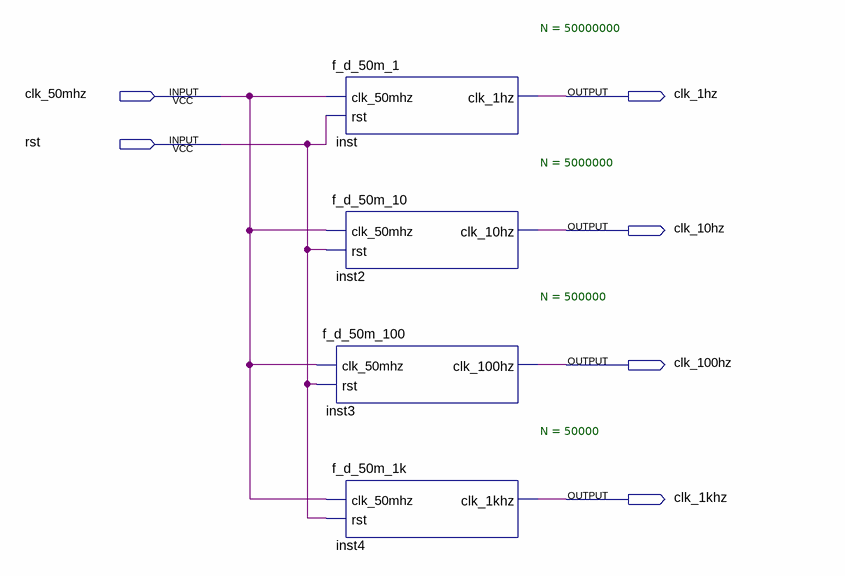
[diagram p0: schematic sheet]
// Quartus schematic f_d.bdf as structural Verilog: 4 symbols, 6 pins
module f_d (
  input  clk_50mhz,
  input  rst,
  output clk_1hz,
  output clk_10hz,
  output clk_100hz,
  output clk_1khz
);

  f_d_50m_1 #(.N(50000000)) inst (.clk_50mhz(clk_50mhz), .rst(rst), .clk_1hz(clk_1hz));
  f_d_50m_10 #(.N(5000000)) inst2 (.clk_50mhz(clk_50mhz), .rst(rst), .clk_10hz(clk_10hz));
  f_d_50m_100 #(.N(500000)) inst3 (.clk_50mhz(clk_50mhz), .rst(rst), .clk_100hz(clk_100hz));
  f_d_50m_1k #(.N(50000)) inst4 (.clk_50mhz(clk_50mhz), .rst(rst), .clk_1khz(clk_1khz));
endmodule
